# Altium schematic sheet PD85004_PP_PA.SchDoc
size 297 x 210 mm
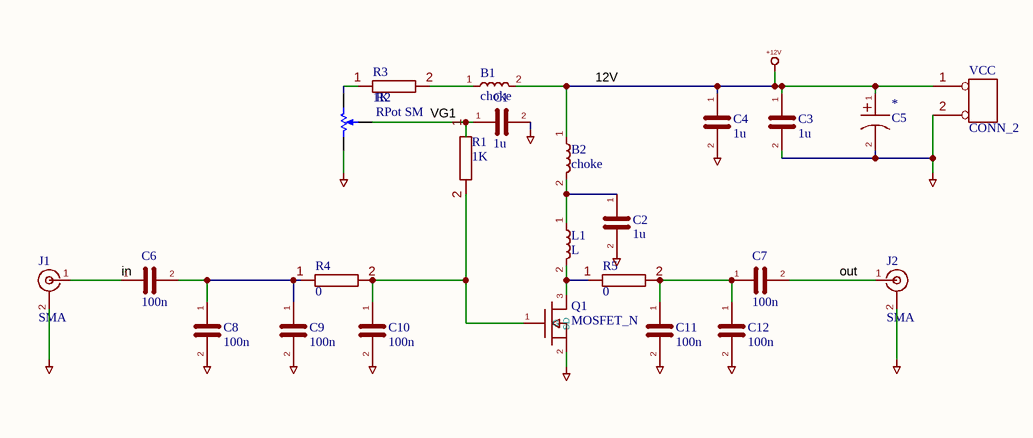
[diagram p0: PD85004_PP_PA.SchDoc]

## Parts
*  C5  [CP]
B1  choke  [Choke]
B2  choke  [Choke]
C1  1u  [6-0805_L]
C2  1u  [6-0805_L]
C3  1u  [6-0805_L]
C4  1u  [6-0805_L]
C6  100n  [6-0805_L]
C7  100n  [6-0805_L]
C8  100n  [6-0805_L]
C9  100n  [6-0805_L]
C10  100n  [6-0805_L]
C11  100n  [6-0805_L]
C12  100n  [6-0805_L]
J1  SMA  [sma]
J2  SMA  [sma]
L1  L  [L]
Q1  MOSFET_N  [pd85004]
R1  1K  [r]
R2  RPot SM  [POT4MM-2]
R3  1K  [r]
R4  0  [r]
R5  0  [r]
VCC  CONN_2  [con1]

## Nets
12V: *.1 B1.2 B2.1 C3.1 C4.1 VCC.1(P1)  [also labelled +12V]
GND: *.2 C1.2 C2.2 C3.2 C4.2 C8.2 C9.2 C10.2 C11.2 C12.2 J1.2(GND) J2.2(GND) Q1.2(S) R2.CW(+) VCC.2(PM)
in: C6.1 J1.1(RF)
out: C7.2 J2.1(RF)
VG1: C1.1 R1.1 R2.W
NetB1_1: B1.1 R3.2
NetB2_2: B2.2 C2.1 L1.1
NetC6_2: C6.2 C8.1 C9.1 R4.1
NetC7_1: C7.1 C11.1 C12.1 R5.2
NetC10_1: C10.1 Q1.1(G) R1.2 R4.2
NetL1_2: L1.2 Q1.3(D) R5.1
NetR2_CCW: R2.CCW(-) R3.1

## Notes on the sheet
- 1
- 2
- 3
- 4
- 5
- 6
- A
- B
- C
- D
- Title: HF Push-pull amplifier
- File: PD85004_PP_PA.sch
- Sheet: /
- OTD electronics
- KiCad E.D.A.  kicad (5.1.4)-1
- Size: A4
- Date: Wednesday, August 20, 2014
- Rev: 1.1
- Id: 1/1
- (in symbol CP1) +

## Library data of the parts
* = CP1
C1-C4 C6-C12 = C
R1 R3-R5 = R
R2 = RPot SM: Square Trimming Potentiometer; Published: 17-Dec-2003; DatasheetVersion: Oct-2003; PackageReference: POT4MM-2; Publisher: Altium Limited; PackageDescription: Square Trimming Potentiometer; ComponentLink1Description: Manufacturer Link; ComponentLink1URL: http://bourns.com/2/search.html